# Altium project Temperature_sensor.PrjPcb
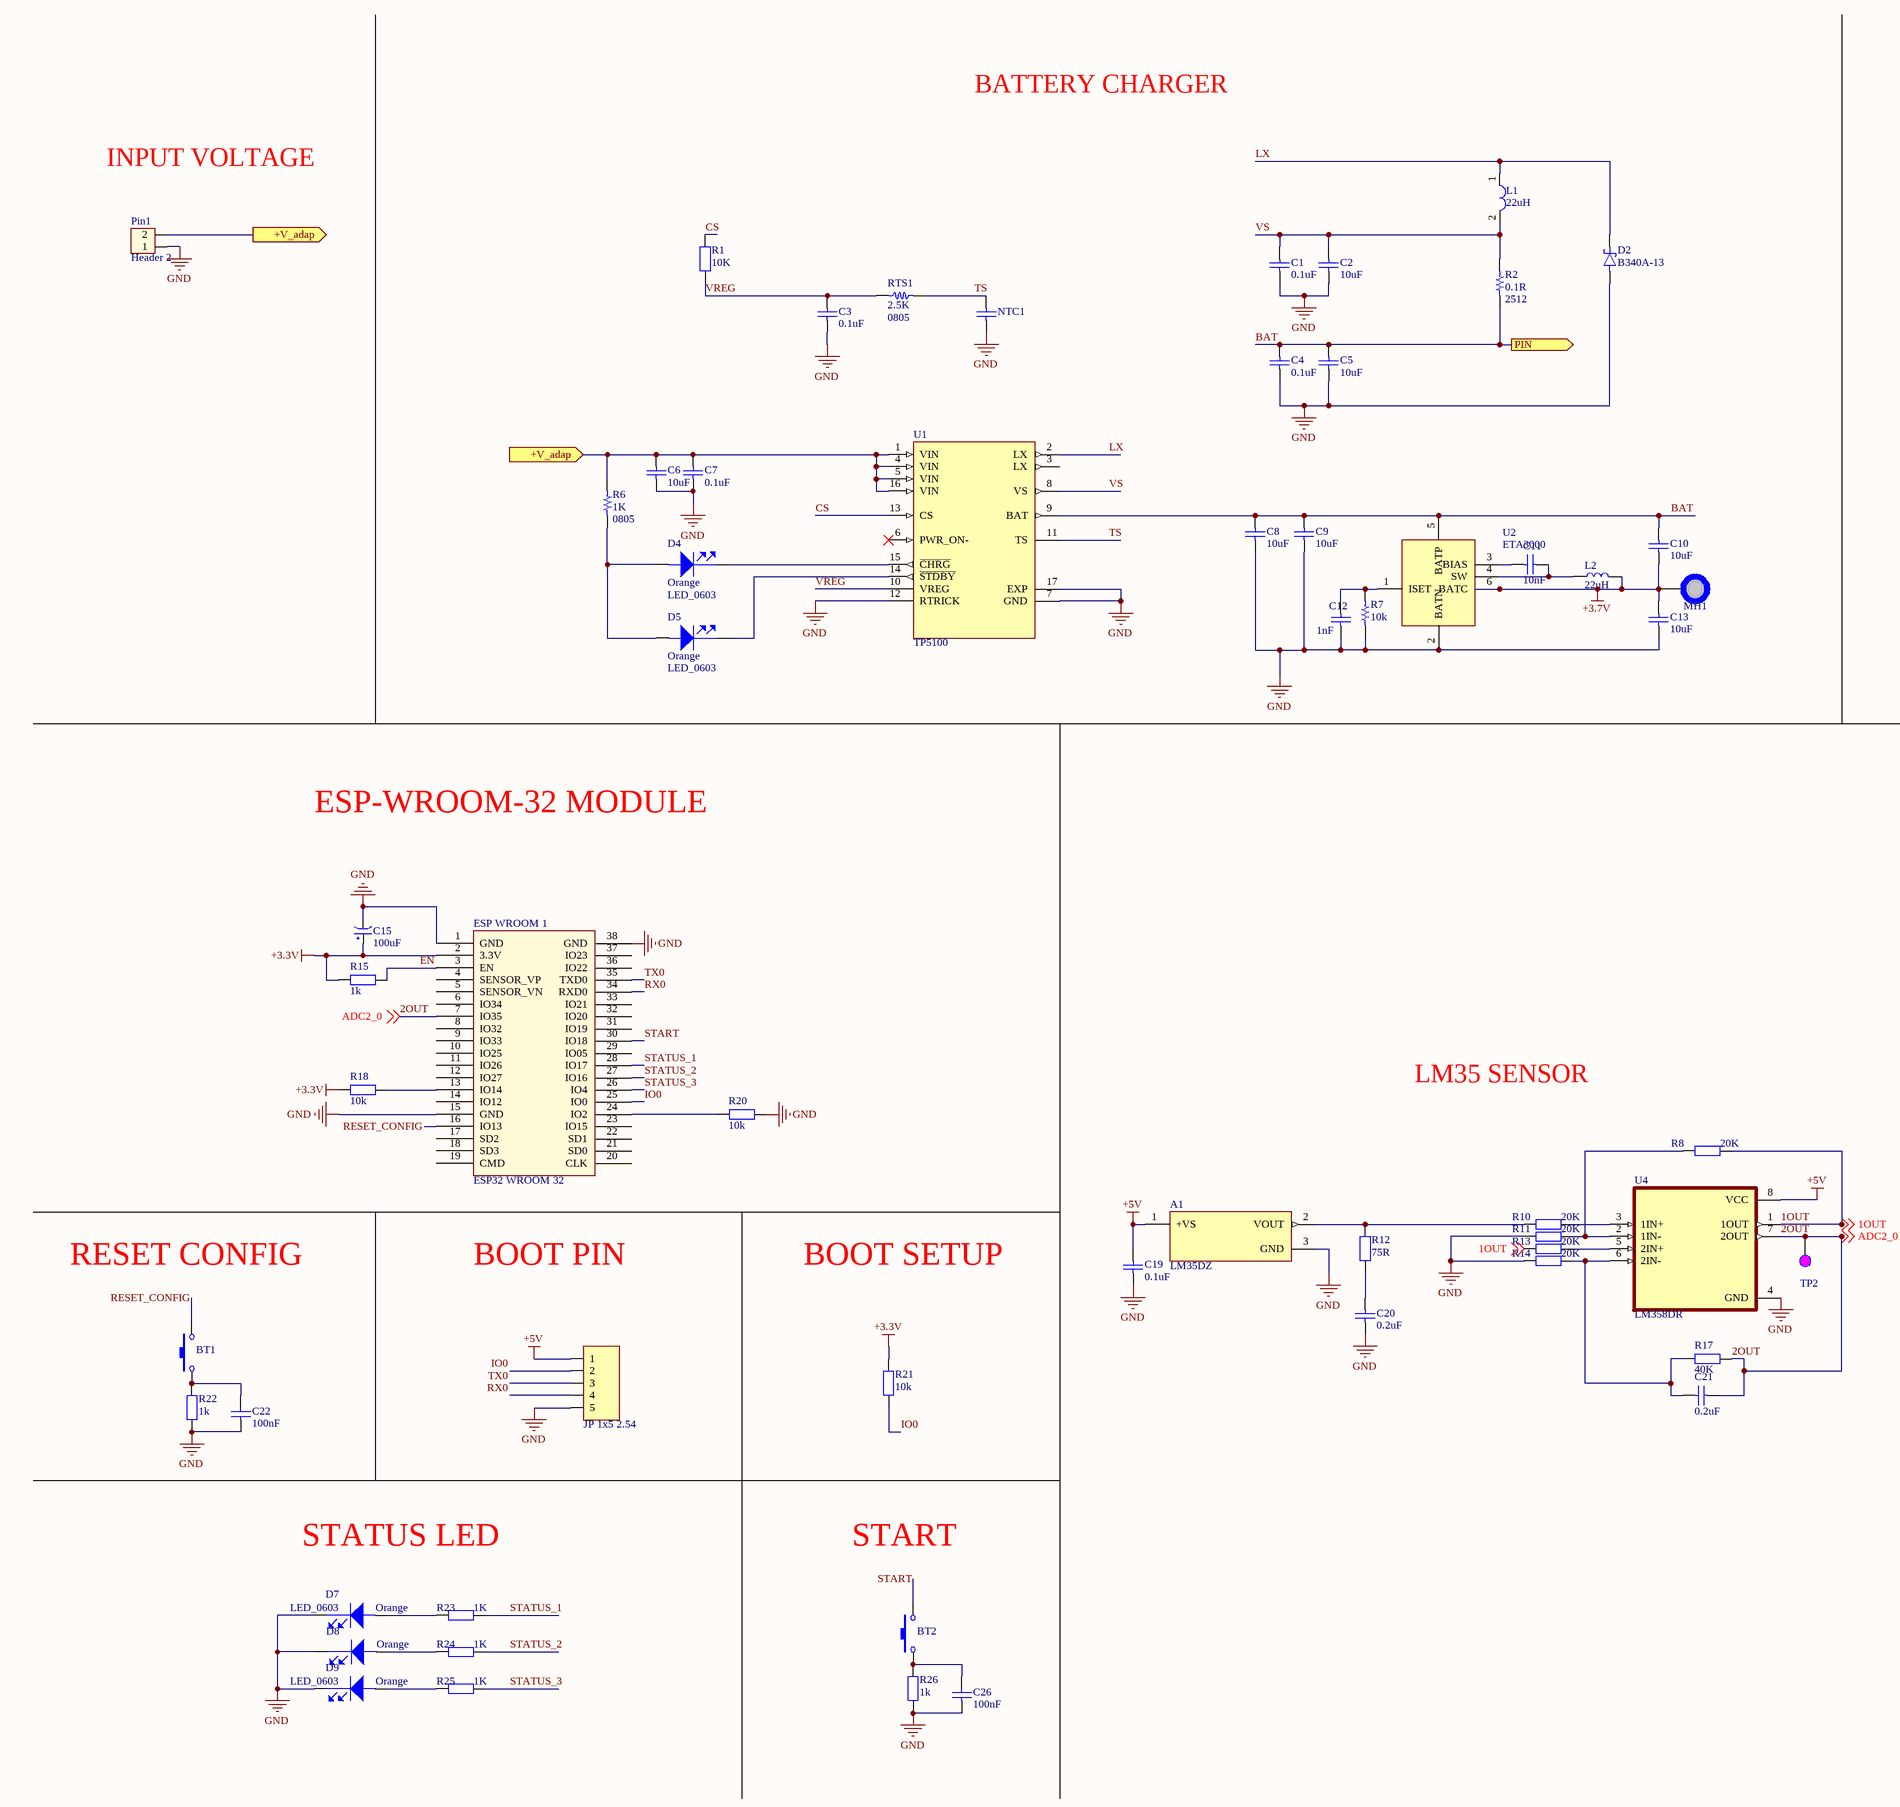
[diagram p0: Sheet1.SchDoc, left]
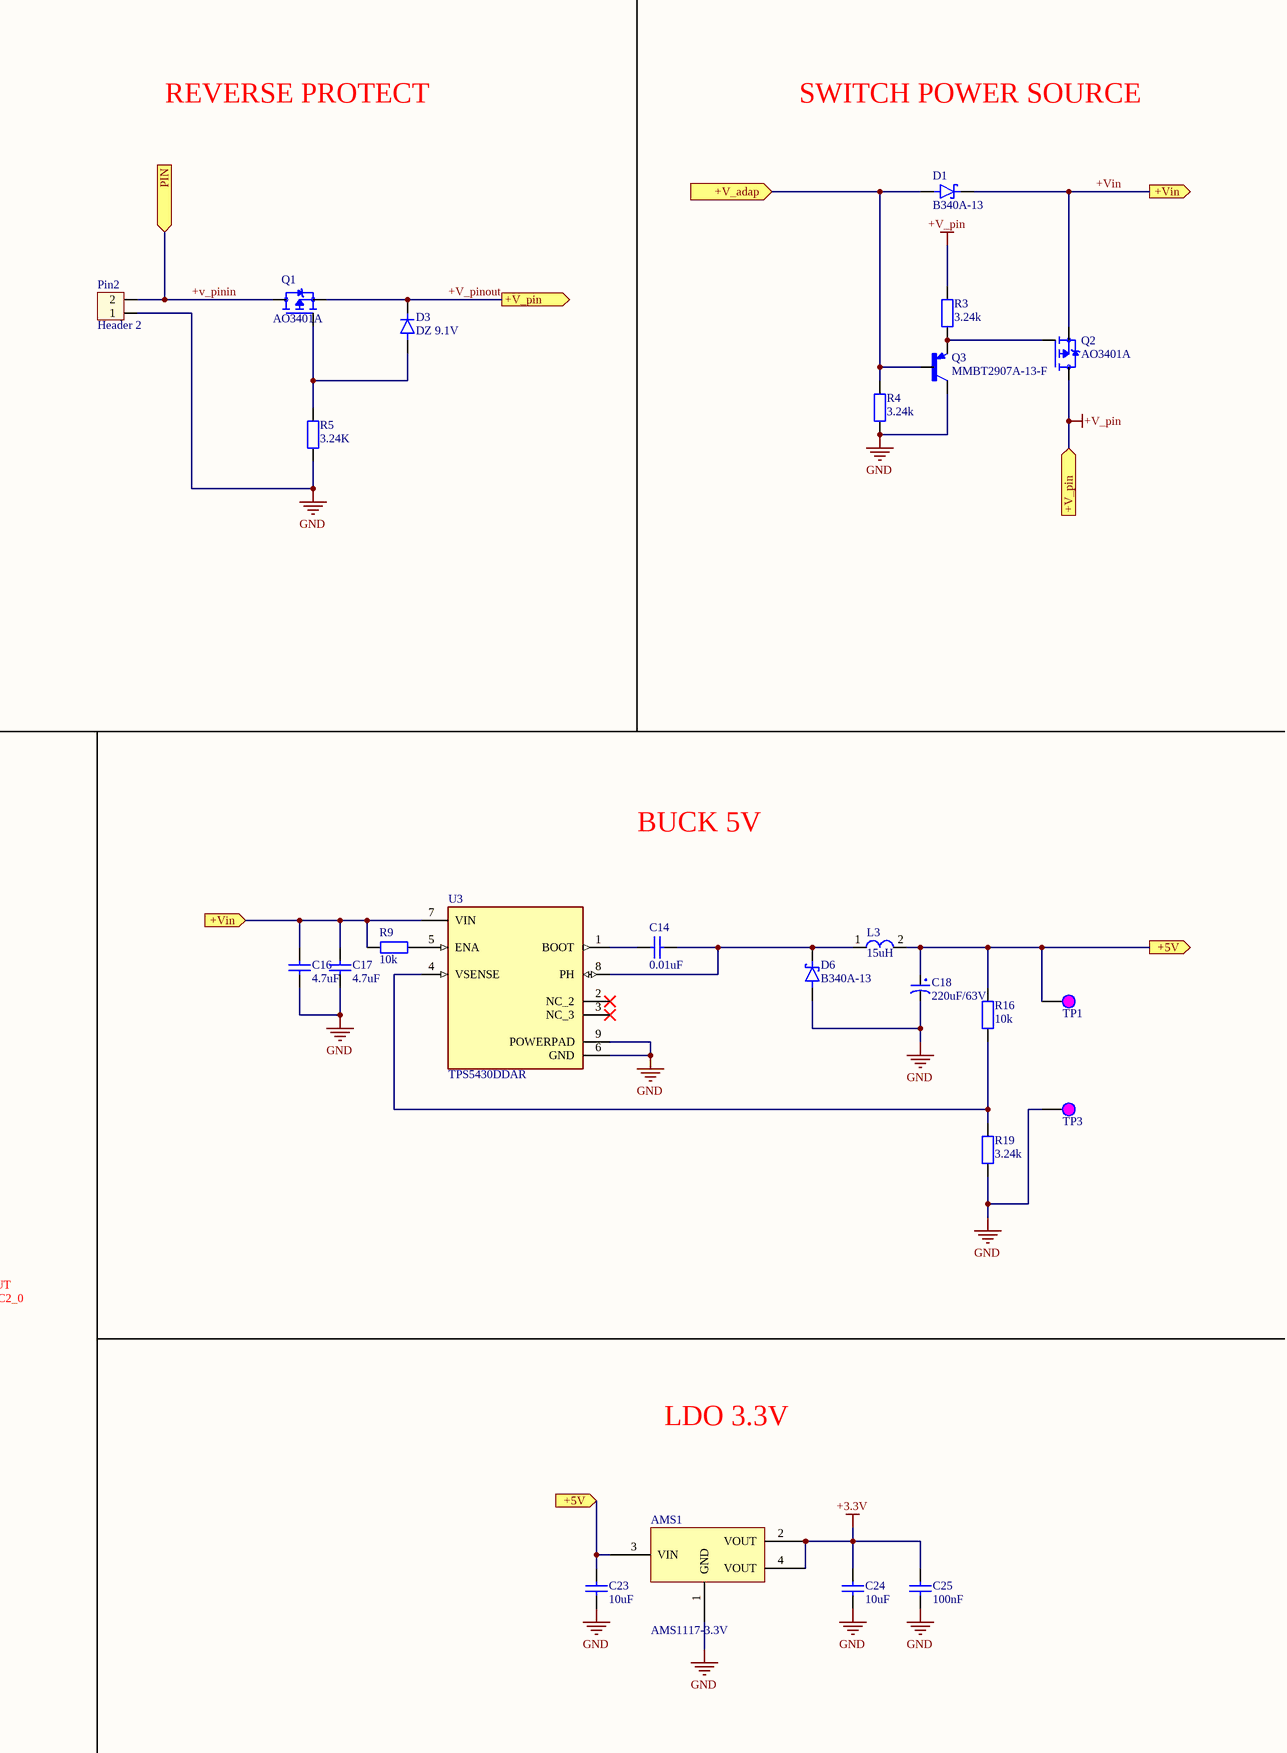
[diagram p1: Sheet1.SchDoc, right]
1 sheet, 85 parts. Net scope: flat (ports and power ports of the same name join across sheets).
Board file: PCB1.PcbDoc

## Sheet Sheet1.SchDoc
size 635 x 381 mm; SheetNumber: 1; SheetTotal: 1

### Parts
A1  LM35DZ  [TO92127P521H735-3]
AMS1  AMS1117-3.3V  [SOT223]
BT1  Nut Nhan 2 Chan SMD 3x6x2.5  [Nut Nhan 2 Chan SMD 3x6x2.5]  (value not drawn)
BT2  Nut Nhan 2 Chan SMD 3x6x2.5  [Nut Nhan 2 Chan SMD 3x6x2.5]  (value not drawn)
C1  0.1uF  [tu 0805]
C2  10uF  [tu 0805]
C3  0.1uF  [tu 0805]
C4  0.1uF  [tu 0805]
C5  10uF  [tu 0805]
C6  10uF  [tu 0805]
C7  0.1uF  [tu 0805]
C8  10uF  [tu 0805]
C9  10uF  [tu 0805]
C10  10uF  [tu 0805]
C11  10nF  [tu 0805]
C12  1nF  [tu 0805]
C13  10uF  [tu 0805]
C14  0.01uF  [tu 0805]
C15  100uF  [tu tantalum smd3528]
C16  4.7uF  [tu 0805]
C17  4.7uF  [tu 0805]
C18  220uF/63V  [CAP_ALUM_D070_S35_H115]
C19  0.1uF  [tu 0805]
C20  0.2uF  [tu 0805]
C21  0.2uF  [tu 0805]
C22  100nF  [C0603C/1608MM]
C23  10uF  [C0603C/1608MM]
C24  10uF  [C0603C/1608MM]
C25  100nF  [C0603C/1608MM]
C26  100nF  [C0603C/1608MM]
D1  B340A-13  [DIOM5226X240N]
D2  B340A-13  [DIOM5226X240N]
D3  DZ 9.1V  [DIOM4330X250N]
D4  Orange  Package / Case: LED_0603  [LED_0603_0m65]
D5  Orange  Package / Case: LED_0603  [LED_0603_0m65]
D6  B340A-13  [DIOM5226X240N]
D7  Orange  Package / Case: LED_0603  [LED_0603_0m65]
D8  Orange  [LED_0603_0m65]
D9  Orange  Package / Case: LED_0603  [LED_0603_0m65]
ESP_WROOM_1  ESP32 WROOM 32  [ESP32-WROOM-32D]
JP1  JP 1x5 2.54  [JP 1x5 DT]
L1  22uH  [L-SMD-M-7.3x4.5]
L2  22uH  [IND 22uH]
L3  15uH  [L-SMD-M-7.3x4.5]
MH1  MH_3MMD_1.5MMH  [MH_3MMD_1.5MMH]  (value not drawn)
NTC1  MF52A103F3950 NTC Thermistors 10K 1% 3950  [tu gom]  (value not drawn)
Pin1  Header 2  [HED2]
Pin2  Header 2  [HED2]
Q1  AO3401A  [SOT23-3]
Q2  AO3401A  [SOT23-3]
Q3  MMBT2907A-13-F  [TRANS_MMBT2907A-13-F]
R1  10K  [tro smd 0805]
R2  0.1R  Case/Package: 2512  [R2512B/6332MM]
R3  3.24k  [tro smd 0805]
R4  3.24k  [tro smd 0805]
R5  3.24K  [tro smd 0805]
R6  1K  Case/Package: 0805  [R0805B/2012MM]
R7  10k  [R0603B/1608MM]
R8  20K  [tro smd 0805]
R9  10k  [tro smd 0805]
R10  20K  [tro smd 0805]
R11  20K  [tro smd 0805]
R12  75R  [tro smd 0805]
R13  20K  [tro smd 0805]
R14  20K  [tro smd 0805]
R15  1k  [tro smd 0603]
R16  10k  [tro smd 0805]
R17  40K  [tro smd 0805]
R18  10k  [tro smd 0603]
R19  3.24k  [tro smd 0805]
R20  10k  [tro smd 0603]
R21  10k  [tro smd 0603]
R22  1k  [tro smd 0603]
R23  1K  [tro smd 0805]
R24  1K  [tro smd 0805]
R25  1K  [tro smd 0805]
R26  1k  [tro smd 0603]
RTS1  2.5K  Case/Package: 0805  [R0805B/2012MM]
TP1  Testpoint 2  [TP - 2]  (value not drawn)
TP2  Testpoint 2  [TP - 2]  (value not drawn)
TP3  Testpoint 2  [TP - 2]  (value not drawn)
U1  TP5100  [QFN65P400X400X90-17N]
U2  ETA3000  [ETA300]
U3  TPS5430DDAR  [CONV_TPS5430DDAR]
U4  LM358DR  [SOIC127P599X175-8N]

### Ports
+5V (in), +5V (out), +V_adap (in), +V_adap (out), +V_pin (in), +V_pin (out), +Vin (in), +Vin (out), PIN (in), PIN (out)

### Nets
+3.3V: AMS1.2(VOUT) AMS1.4(VOUT) C15.1 C24.2 C25.2 ESP_WROOM_1.2(3.3V) R15.2 R18.2 R21.1
+3.7V: C10.2 C13.1 L2.2 MH1.1 U2.6(BATC)
+5V: A1.1(+VS) C19.1 JP1.1 U4.8(VCC)
+V_pinout: D3.C(K) Q1.2(S) Q2.3(D) R3.2 ; port +V_pin  [also labelled +V_pin]
GND: A1.3(GND) AMS1.1(GND) C1.2 C2.2 C3.2 C4.2 C5.2 C6.2 C7.2 C8.2 C9.2 C12.2 C13.2 C15.2 C16.2 C17.2 C18.2 C19.2 C20.2 C22.1 C23.1 C24.1 C25.1 C26.1 D2.A D6.A D7.2(cathode) D8.2(cathode) D9.2(cathode) ESP_WROOM_1.1(GND) ESP_WROOM_1.15(GND) ESP_WROOM_1.38(GND) JP1.5 NTC1.2 Pin1.1 Pin2.1 Q3.3(C) R4.1 R5.1 R7.1 R11.2 R14.2 R19.1 R20.1 R22.1 R26.1 TP3.1 U1.7(GND) U1.12(RTRICK) U1.17(EXP) U2.2(BATN) U3.6(GND) U3.9(POWERPAD) U4.4(GND)
1OUT: R8.1 R13.2 U4.1(1OUT) ; off-sheet 1OUT
2OUT: C21.2 ESP_WROOM_1.7(IO35) R17.2 TP2.1 U4.7(2OUT) ; off-sheet ADC2_0  [also labelled ADC2_0]
+v_pinin: C4.1 C5.1 C8.1 C9.1 C10.1 Pin2.2 Q1.3(D) R2.1 U1.9(BAT) U2.5(BATP) ; port PIN  [also labelled BAT]
+Vin: C16.1 C17.1 D1.C Q2.2(S) R9.2 U3.7(VIN) ; port +Vin
CS: R1.2 U1.13(CS)
EN: ESP_WROOM_1.3(EN) R15.1
IO0: ESP_WROOM_1.25(IO0) JP1.2 R21.2
LX: D2.C L1.1 U1.2(LX)
RESET_CONFIG: BT1.2 ESP_WROOM_1.16(IO13)
RX0: ESP_WROOM_1.34(RXD0) JP1.4
START: BT2.2 ESP_WROOM_1.30(IO18)
STATUS_1: ESP_WROOM_1.28(IO17) R23.2
STATUS_2: ESP_WROOM_1.27(IO16) R24.2
STATUS_3: ESP_WROOM_1.26(IO4) R25.2
TS: NTC1.1 RTS1.1 U1.11(TS)
TX0: ESP_WROOM_1.35(TXD0) JP1.3
VREG: C3.1 R1.1 RTS1.2 U1.10(VREG)
VS: C1.1 C2.1 L1.2 R2.2 U1.8(VS)
NetA1_2: A1.2(VOUT) R10.1 R12.2
NetAMS1_3: AMS1.3(VIN) C18.1 C23.2 L3.2 R16.2 TP1.1 ; port +5V
NetBT1_1: BT1.1 C22.2 R22.2
NetBT2_1: BT2.1 C26.2 R26.2
NetC6_1: C6.1 C7.1 D1.A Pin1.2 Q3.1(B) R4.2 R6.2 U1.1(VIN) U1.4(VIN) U1.5(VIN) U1.16(VIN) ; port +V_adap
NetC11_1: C11.1 U2.3(BIAS)
NetC11_2: C11.2 L2.1 U2.4(SW)
NetC12_1: C12.1 R7.2 U2.1(ISET)
NetC14_1: C14.1 U3.1(BOOT)
NetC14_2: C14.2 D6.C L3.1 U3.8(PH)
NetC20_1: C20.1 R12.1
NetC21_1: C21.1 R14.1 R17.1 U4.6(2IN-)
NetD3_A: D3.A Q1.1(G) R5.2
NetD4_1: D4.1(ANODE) D5.1(ANODE) R6.1
NetD4_2: D4.2(cathode) U1.15(~{CHRG})
NetD5_2: D5.2(cathode) U1.14(~{STDBY})
NetD7_1: D7.1(ANODE) R23.1
NetD8_1: D8.1(ANODE) R24.1
NetD9_1: D9.1(ANODE) R25.1
NetESP_WROOM_1_13: ESP_WROOM_1.13(IO14) R18.1
NetESP_WROOM_1_24: ESP_WROOM_1.24(IO2) R20.2
NetQ2_1: Q2.1(G) Q3.2(E) R3.1
NetR8_2: R8.2 R11.1 U4.2(1IN-)
NetR9_1: R9.1 U3.5(ENA)
NetR10_2: R10.2 U4.3(1IN+)
NetR13_1: R13.1 U4.5(2IN+)
NetR16_1: R16.1 R19.2 U3.4(VSENSE)

Not connected (* = marked no-connect by the designer): ESP_WROOM_1 4(SENSOR_VP) 5(SENSOR_VN) 6(IO34) 8(IO32) 9(IO33) 10(IO25) 11(IO26) 12(IO27) 14(IO12) 17(SD2) 18(SD3) 19(CMD) 20(CLK) 21(SD0) 22(SD1) 23(IO15) 29(IO05) 31(IO19) 32(IO20) 33(IO21) 36(IO22) 37(IO23); U1 3(LX) 6(PWR_ON-)*; U3 2(NC_2)* 3(NC_3)*

### Notes on the sheet
- BATTERY CHARGER
- INPUT VOLTAGE
- REVERSE PROTECT
- SWITCH POWER SOURCE
- ESP-WROOM-32 MODULE
- BUCK 5V
- LM35 SENSOR
- RESET CONFIG
- BOOT PIN
- BOOT SETUP
- LDO 3.3V
- STATUS LED
- START

### Library data of the parts
A1 = LM35DZ/NOPB: Temperature Sensor Analog, Local 0Â°C ~ 100Â°C 10mV/Â°C TO-92-3; MF: Texas Instruments; Price: None; Availability: In Stock; Package: E-PKG AXIAL-LEADED-2 ON Semiconductor; MP: LM35DZ; Value: *; SnapEDA_Link: https://www.snapeda.com/parts/LM35DZ/Texas+Instruments/view-part/?ref=snap; Purchase-URL: https://pricing.snapeda.com/search/part/LM35DZ/?ref=eda; Check_prices: https://www.snapeda.com/parts/LM35DZ/Texas+Instruments/view-part/?ref=eda
AMS1 = AMS1117 SMD: Dán; Value: AMS1117-3.3V SOT223; Don_Vi: Con; Ma_Hang: MH000596; Ghi_Chu: *; Kieu_Chan: *; Chung_Loai: Dán
BT1 BT2 = Nut Nhan 2 Chan SMD 3x6x2.5: Ma_Hang: MH001036; Ten: Nút Nhấn 2 Chân 3x6x2.5MM SMD
C1-C14 C16 C17 C19-C21 = Tu 0805 10pF 50V 10%: Dán; Don_Vi: Con; So_Chan: 2; Ten_Linh_Kien: Tụ 0805 10P 10% 50V; Ma_Hang: MH004554; Chung_Loai: Dán; Kieu_Chan: *
C15 = Tu tantalum 100uF 6.3V SMD3528: Dán; Don_Vi: Con; So_Chan: 2; Ten_Linh_Kien: Tụ tantalum 107J-100uF 6.3V SMD3528; Ma_Hang: MH007595; Chung_Loai: Dán; Kieu_Chan: *
C18 = CAP ALUM 47UF 20% 63V RADIAL: Cap Aluminum 47uF 63V 20% (8 X 11.5mm) Radial 3.5mm 405mA 3000 hr 105C Ammo Pack; Manufacturer: Nichicon; Manufacturer Part Number: UPW1J470MPD1TD; Dielectric Material: Aluminium; ESR (Equivalent Series Resistance): 684mR; Impedance: 342mR; Life (Hours): 3000Hour; Supplier 1: Digi-Key; Stock 1: 26935; Pricing 1: 1=0.45, 10=0.321, 50=0.2424, 100=0.2111, 500=0.15634 (USD); Mount: Through Hole; Case/Package: Radial; Min Operating Temperature: -55°C; Max Operating Temperature: 105°C; Capacitance: 47uF; Tolerance: 20%; Ripple Current: 405mA; Voltage Rating: 63V; Package Quantity: 1000; Packaging: Tape and Reel; Termination: Radial; Voltage Rating (DC): 63V; Series: UPW; Diameter: 8mm; Height: 11.5mm; Lead Pitch: 3.5mm; Height - Seated (Max): 0.512inch; Radiation Hardening: No; Reach SVHC Compliant: Yes; Lead Free: Lead Free; RoHS Compliant: Yes; ComponentLink1URL: https://datasheet.ciiva.com/7907/e-pw-7907438.pdf?src-supplier=Element14; ComponentLink1Description: https://datasheet.ciiva.com/7907/e-pw-7907438.pdf?src-supplier=Element14; ComponentLink2URL: https://datasheet.ciiva.com/46391/1909381-46391130.pdf?src-supplier=Element14; ComponentLink2Description: https://datasheet.ciiva.com/46391/1909381-46391130.pdf?src-supplier=Element14; ComponentLink3URL: https://datasheet.ciiva.com/29546/e-pw-29546670.pdf?src-supplier=Digi-Key; ComponentLink3Description: https://datasheet.ciiva.com/29546/e-pw-29546670.pdf?src-supplier=Digi-Key; ComponentLink4URL: https://datasheet.ciiva.com/29546/e-pw-29546669.pdf?src-supplier=Digi-Key; ComponentLink4Description: https://datasheet.ciiva.com/29546/e-pw-29546669.pdf?src-supplier=Digi-Key; ComponentLink5URL: https://datasheet.ciiva.com/16502/e-pw-16502651.pdf?src-supplier=Future+Electronics; ComponentLink5Description: https://datasheet.ciiva.com/16502/e-pw-16502651.pdf?src-supplier=Future+Electronics; Supplier Part Number 1: 493-11607-1-ND
C22 C25 C26 = CAP CER 100nF 16V 5% X7R 0603: Cap Ceramic 0.1uF 16V X7R 5% SMD 0603 125C T/R; Manufacturer: Yageo; Manufacturer Part Number: CC0603JRX7R7BB104; Supplier 1: Digi-Key; Stock 1: 333951; Pricing 1: 1=0.1, 10=0.077, 50=0.042, 100=0.0343, 500=0.02448, 1000=0.01923 (USD); Mount: Surface Mount; Case/Package: 0603; Number of Pins: 2; Case Code (Metric): 1608; Case Code (Imperial): 0603; Min Operating Temperature: -55°C; Max Operating Temperature: 125°C; Capacitance: 100nF; Tolerance: 5%; Voltage Rating: 16V; Packaging: Tape and Reel; Dielectric: X7R; Voltage Rating (DC): 16V; Series: CC; Length: 1.6mm; Width: 0.031inch; Thickness: 0.035inch; Depth: 0.8mm; Radiation Hardening: No; Lead Free: Lead Free; Halogen Free: Halogen Free; RoHS Compliant: Yes; ComponentLink1URL: https://www.verical.com/server-webapp/html/getDatasheet?partID=403543&src-supplier=Verical; ComponentLink1Description: https://www.verical.com/server-webapp/html/getDatasheet?partID=403543&src-supplier=Verical; Supplier Part Number 1: 311-1776-1-ND
C23 C24 = CAP CER 10uF 16V X7R 0603: CAP CER 0603 10uF 16V X7R 10%
D1 D2 D6 = B340A-13: Diode Schottky 40 V 3A Surface Mount SMA; MF: Diodes Inc.; Value: *; MP: B340A-13; Package: DO-214 Diodes Inc.; Availability: In Stock; Price: None; SnapEDA_Link: https://www.snapeda.com/parts/B340A-13/Diodes+Inc./view-part/?ref=snap; Check_prices: https://www.snapeda.com/parts/B340A-13/Diodes+Inc./view-part/?ref=eda; Purchase-URL: https://pricing.snapeda.com/search/part/B340A-13/?ref=eda
D3 = RS1G: 1A, 50V - 1000V Fast Surface Mount Rectifier; MF: Taiwan Semiconductor; Package: DO-214AC-2 Taiwan Semiconductor; Price: None; Value: *; SnapEDA_Link: https://www.snapeda.com/parts/RS1G/Taiwan+Semiconductor/view-part/?ref=snap; MP: RS1G; Availability: In Stock; Check_prices: https://www.snapeda.com/parts/RS1G/Taiwan+Semiconductor/view-part/?ref=eda
D4 D5 D7-D9 = LED ORANGE 606NM 0603: LED SMARTLED ORANGE 606NM 0603; Manufacturer: OSRAM Opto Semiconductors Inc; Manufacturer Part Number: LO L29K-H2K1-24-Z; Millicandela Rating: 6.3mcd; Voltage - Forward (Vf) Typ: 1.8V; Current - Test: 2mA; Wavelength - Peak: 610nm; Viewing Angle: 160°; Lens Type: Diffused; Lens Style/Size: Rectangle with Flat Top, 1.3mm x 0.8mm; Luminous Flux @ Current - Test: 25 mlm; By: Hieu.Nguyen_20191030; Supplier 1: Digi-Key; Supplier Part Number 1: 475-2740-1-ND; RoHS: RoHS Compliant; Category: Optoelectronics; Stock 1: 15900; Pricing 1: 1=0.17, 10=0.141, 100=0.1127, 250=0.0986, 500=0.09016 (USD); Color: Orange; Wavelength - Dominant: 606nm; Size / Dimension: 1.70mm L x 0.80mm W; Height: 0.65mm; Mounting Type: Surface Mount; Packaging: Cut Tape (CT); ComponentLink1URL: http://catalog.osram-os.com/catalogue/catalogue.do;jsessionid=302CF83AF637AE24E40AEB0ADA267EDD?act=downloadFile&favOid=020000010003f9de000100b6; ComponentLink1Description: http://catalog.osram-os.com/catalogue/catalogue.do;jsessionid=302CF83AF637AE24E40AEB0ADA267EDD?act=downloadFile&favOid=020000010003f9de000100b6
JP1 = JP 1x5 2.54 Duc Thang: Cắm; Ten_Linh_Kien: Jump Đơn Đực 2.54MM 1x40P Thẳng 11MM; Don_Vi: Con; Ma_Hang: MH000903; Ghi_Chu: *; Kieu_Chan: *; Chung_Loai: Cắm
L1 L3 = L-SMD-1: partNo: 78477010; Manufacturer: Wurth Elektronik; Inductance: 1.0 μH; ComponentLink1Description: Manufacturer; ComponentLink1URL: http://www.we-online.de; Created by: Baojun Chen; Created Date: Nov.2015; ComponentLink2Description: Datasheet; ComponentLink2URL: http://katalog.we-online.de/pbs/datasheet/78477010.pdf
L2 = IND FIXED 22UH 3A 50 MOHM SMD CD104-220 10x10x4mm: Inductor Power Shielded Wirewound 22uH 20% 100KHz Ferrite 3A 0.05Ohm DCR Automotive T/R; Manufacturer: Wurth Electronics; Manufacturer Part Number: 7447714220; Saturation Current: 3.6A; DC Resistance (DCR): 50mR; Self Resonant Frequency: 14.5MHz; Supplier 1: Digi-Key; Stock 1: 9408; Pricing 1: 1=2.26, 10=2.172, 50=1.961, 100=1.759, 250=1.61 (USD); Mount: Surface Mount; Case/Package: Nonstandard; Core Material: Ferrite; Min Operating Temperature: -40°C; Max Operating Temperature: 125°C; Package Quantity: 1; Current Rating: 3A; Tolerance: 20%; Shielding: Shielded; Packaging: Tape and Reel; Inductance Tolerance: 20%; Inductance: 22uH; Resistor Type: Wirewound; Test Frequency: 100kHz; Max DC Current: 3A; Termination: SMD/SMT; RMS Current (Irms): 3A; Series: WE-PD; Resistance: 50mR; Series Resistance: 50mR; Length: 10mm; Width: 10mm; Height: 5mm; Height - Seated (Max): 0.197inch; Depth: 10mm; Ratings: AEC-Q200; RoHS Compliant: Yes; ComponentLink1URL: https://datasheet.ciiva.com/13320/7447714220-70113-13320863.pdf?src-supplier=Mouser; ComponentLink1Description: https://datasheet.ciiva.com/13320/7447714220-70113-13320863.pdf?src-supplier=Mouser; ComponentLink2URL: https://datasheet.ciiva.com/1058/7447714220-1058608.pdf?src-supplier=Digi-Key; ComponentLink2Description: https://datasheet.ciiva.com/1058/7447714220-1058608.pdf?src-supplier=Digi-Key; ComponentLink3URL: https://datasheet.ciiva.com/30489/0900766b81281c0b-30489748.pdf?src-supplier=Rs; ComponentLink3Description: https://datasheet.ciiva.com/30489/0900766b81281c0b-30489748.pdf?src-supplier=Rs; ComponentLink4URL: https://datasheet.ciiva.com/7691/1736273-7691674.pdf?src-supplier=Element14; ComponentLink4Description: https://datasheet.ciiva.com/7691/1736273-7691674.pdf?src-supplier=Element14; ComponentLink5URL: https://datasheet.ciiva.com/1058/7447714220-1058609.pdf?src-supplier=Digi-Key; ComponentLink5Description: https://datasheet.ciiva.com/1058/7447714220-1058609.pdf?src-supplier=Digi-Key; ComponentLink6URL: https://datasheet.ciiva.com/48691/001087798-da-01-ml-we-pd-smd-speicherdrossel-74477142-de-en-48691509.pdf?src-supplier=Conrad; ComponentLink6Description: https://datasheet.ciiva.com/48691/001087798-da-01-ml-we-pd-smd-speicherdrossel-74477142-de-en-48691509.pdf?src-supplier=Conrad; Supplier Part Number 1: 732-2992-1-ND
MH1 = MH_3MMD_1.5MMH: Mounting Hole 3mm Diameter, 1.5mm Hole
NTC1 = Tu gom 203 50V: Cắm; Don_Vi: Con; So_Chan: 2; Ten_Linh_Kien: Tụ gốm 203 -20nF 50V; Ma_Hang: MH007482; Chung_Loai: Cắm; Kieu_Chan: *
Pin1 Pin2 = Hed2: Header 2 (Green); Value: Header 2
Q1 Q2 = AO3401A: P-Channel 30V 4A _Ta_ 1.4W _Ta_ Surface Mount SOT-23-3L; MF: Alpha &; Package: SOT-23 Alpha &amp; Omega Semiconductor; Value: *; MP: AO3401A; Availability: Unavailable; SnapEDA_Link: https://www.snapeda.com/parts/AO3401A/Alpha%20&%20Omega%20Semiconductor%20Inc./view-part/227978/?ref=snap; Price: None
Q3 = MMBT2907A-13-F: Trans GP BJT PNP 60V 0.6A 350mW 3-Pin SOT-23 T/R; MF: Diodes Inc.; SnapEDA_Link: https://www.snapeda.com/parts/MMBT2907A-13-F/Diodes+Inc./view-part/?ref=snap; Price: None; Check_prices: https://www.snapeda.com/parts/MMBT2907A-13-F/Diodes+Inc./view-part/?ref=eda; Availability: In Stock; Package: SOT-23 Diodes Inc.; MP: MMBT2907A-13-F; Value: *
R1 R5 = Tro 0805 5% 560R: Dán; Don_Vi: Con; So_Chan: 2; Ten_Linh_Kien: Trở 0805 5% 560R; Ma_Hang: MH005261; Chung_Loai: Dán; Kieu_Chan: *
R2 = RES SMD 0.2 OHM 5% 1W 2512: Surface Mount Thick Film Resistor, RC Series, 10 kohm, 1W, - 5%, 50 V, 2512; Manufacturer: Yageo; Manufacturer Part Number: RC0603JR-0710KL; Resistance: 10kR; Temperature Coefficient: 100ppm/°C; Voltage Rating (DC): 50V; Power Rating: 100mW; Supplier 1: Digi-Key; Stock 1: 10996894; Pricing 1: 1=0.1, 10=0.02, 100=0.008, 1000=0.0036, 2500=0.00312 (USD); Number of Pins: 2; Contact Plating: Tin,Matte; Min Operating Temperature: -55°C; Max Operating Temperature: 155°C; Tolerance: 5%; Resistor Type: Thick Film; Packaging: Tape and Reel; Voltage Rating: 50V; Termination: SMD/SMT; Features: Moisture Resistant; Max Power Dissipation: 1W; Number of Terminations: 2; Length: 0.063inch; Width: 0.031inch; Depth: 0.8mm; Height - Seated (Max): 0.022inch; Radiation Hardening: No; REACH SVHC: Unknown; Lead Free: Lead Free; Military Standard: Not; RoHS Compliant: Yes; ComponentLink1URL: http://www.yageo.com/documents/recent/PYu-RC_Group_51_RoHS_L_10.pdf?src-supplier=Digi-Key; ComponentLink1Description: http://www.yageo.com/documents/recent/PYu-RC_Group_51_RoHS_L_10.pdf?src-supplier=Digi-Key; Supplier Part Number 1: 311-10KGRCT-ND; Case Code (Metric): 6332; Case Code (Imperial): 6332
R3 R4 R8 R10-R14 R17 R19 R23-R25 = Tro 0805 5% 3.3k: Dán; Don_Vi: Con; So_Chan: 2; Ten_Linh_Kien: Trở 0805 5% 3.3k; Ma_Hang: MH005305; Chung_Loai: Dán; Kieu_Chan: *
R6 RTS1 = RES SMD 1.8M OHM 5% 1/8W 0805: Res Thick Film 0805 1.8M Ohm 5% 1/8W ±100ppm/°C Molded SMD SMD Paper T/R; Manufacturer: Yageo; Manufacturer Part Number: RC0805JR-071M8L; Resistance: 1.8MR; Power Rating: 125mW; Voltage Rating: 150V; Supplier 1: Digi-Key; Stock 1: 11875; Pricing 1: 1=0.1, 10=0.036, 100=0.0145, 1000=0.00652, 2500=0.00566 (USD); Contact Plating: Tin,Matte; Case Code (Imperial): 0805; Case Code (Metric): 2012; Size Code: 0805; Min Operating Temperature: -55°C; Max Operating Temperature: 155°C; Tolerance: 5%; Resistor Type: Thick Film; Temperature Coefficient: 100ppm/°C; Packaging: Tape and Reel; Package Quantity: 1; Termination: SMD/SMT; Number of Terminations: 2; Max Power Dissipation: 125mW; Voltage Rating (DC): 150V; Features: Moisture Resistant; Series: RC; Construction: Rectangular; Length: 2mm; Width: 1.25mm; Height: 0.5mm; Depth: 1.25mm; Radiation Hardening: No; Military Standard: Not; Lead Free: Lead Free; RoHS Compliant: Yes; ComponentLink1URL: http://www.yageo.com/documents/recent/PYu-RC_Group_51_RoHS_L_9.pdf?src-supplier=Digi-Key; ComponentLink1Description: http://www.yageo.com/documents/recent/PYu-RC_Group_51_RoHS_L_9.pdf?src-supplier=Digi-Key; ComponentLink2URL: https://www.yageo.com/upload/media/product/productsearch/datasheet/rchip/PYu-RC_Group_51_RoHS_L_10.pdf?src-supplier=Digi-Key; ComponentLink2Description: https://www.yageo.com/upload/media/product/productsearch/datasheet/rchip/PYu-RC_Group_51_RoHS_L_10.pdf?src-supplier=Digi-Key; Supplier Part Number 1: 311-1.8MARDKR-ND
R7 = RES SMD 10K OHM 5% 1/10W 0603: Surface Mount Thick Film Resistor, RC Series, 10 kohm, 100 mW, - 5%, 50 V, 0603 [1608 Metric]; Manufacturer: Yageo; Manufacturer Part Number: RC0603JR-0710KL; Resistance: 10kR; Temperature Coefficient: 100ppm/°C; Voltage Rating (DC): 50V; Power Rating: 100mW; Supplier 1: Digi-Key; Stock 1: 10996894; Pricing 1: 1=0.1, 10=0.02, 100=0.008, 1000=0.0036, 2500=0.00312 (USD); Case/Package: 0603; Number of Pins: 2; Contact Plating: Tin,Matte; Min Operating Temperature: -55°C; Max Operating Temperature: 155°C; Tolerance: 5%; Resistor Type: Thick Film; Packaging: Tape and Reel; Voltage Rating: 50V; Termination: SMD/SMT; Features: Moisture Resistant; Max Power Dissipation: 100mW; Number of Terminations: 2; Length: 0.063inch; Width: 0.031inch; Depth: 0.8mm; Height - Seated (Max): 0.022inch; Radiation Hardening: No; REACH SVHC: Unknown; Lead Free: Lead Free; Military Standard: Not; RoHS Compliant: Yes; ComponentLink1URL: http://www.yageo.com/documents/recent/PYu-RC_Group_51_RoHS_L_10.pdf?src-supplier=Digi-Key; ComponentLink1Description: http://www.yageo.com/documents/recent/PYu-RC_Group_51_RoHS_L_10.pdf?src-supplier=Digi-Key; Supplier Part Number 1: 311-10KGRCT-ND; Case Code (Metric): 1608; Case Code (Imperial): 0603
R9 R16 = Tro 0805 5% 10k: Dán; Don_Vi: Con; So_Chan: 2; Ten_Linh_Kien: Trở 0805 5% 10k; Ma_Hang: MH005239; Chung_Loai: Dán; Kieu_Chan: *
R15 R18 R22 R26 = Tro 0603 1% 1k: Dán; So_Chan: 2; Don_Vi: Con; Ten_Linh_Kien: Trở 0603 1% 1k; Ma_Hang: MH006334; Chung_Loai: Dán; Kieu_Chan: *
R20 R21 = Tro 0603 1% 10k: Dán; Don_Vi: Con; So_Chan: 2; Ten_Linh_Kien: Trở 0603 1% 10k; Ma_Hang: MH006333; Chung_Loai: Dán; Kieu_Chan: *
U1 = TP5100: 2A-switch buck 8.4V / 4.2V rechargeable lithium battery; MF: NanJing Top Power ASIC Corp.; Availability: Not in stock; MP: TP5100; Price: None; Value: *; SnapEDA_Link: https://www.snapeda.com/parts/TP5100/NanJing+Top+Power+ASIC+Corp./view-part/?ref=snap; Check_prices: https://www.snapeda.com/parts/TP5100/NanJing+Top+Power+ASIC+Corp./view-part/?ref=eda; Package: Package
U3 = TPS5430DDAR: 5.5V to 36V Input, 3A, 500kHz Step-Down Converter; MF: Texas Instruments; Package: HSOIC-8 Texas Instruments; Check_prices: https://www.snapeda.com/parts/TPS5430DDAR/Texas+Instruments/view-part/?ref=eda; Value: *; Purchase-URL: https://pricing.snapeda.com/search/part/TPS5430DDAR/?ref=eda; Availability: In Stock; SnapEDA_Link: https://www.snapeda.com/parts/TPS5430DDAR/Texas+Instruments/view-part/?ref=snap; MP: TPS5430DDAR; Price: None
U4 = LM358DR: Dual standard operational amplifier 8-SOIC 0 to 70; MF: Texas Instruments; Availability: Good; Mouser-Purchase-URL: https://snapeda.com/shop?store=Mouser&id=231187; SnapEDA_Link: https://www.snapeda.com/parts/LM358DR/Texas%20Instruments/view-part/231187/?ref=snap; Price: None; MP: LM358DR; Value: *; Texas_Instruments-Purchase-URL: https://snapeda.com/shop?store=Texas+Instruments&id=231187; Package: SOIC-8 Texas Instruments; DigiKey-Purchase-URL: https://snapeda.com/shop?store=DigiKey&id=231187; BuyPart: https://www.snapeda.com/parts/LM358DR/Texas%20Instruments/view-part/231187/?ref=eda